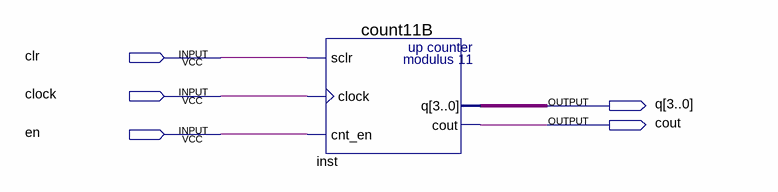
[diagram p0: schematic sheet]
// Quartus schematic cnt11B.bdf as structural Verilog: 1 symbols, 5 pins
module cnt11B (
  input  clr,
  input  clock,
  input  en,
  output [3:0] q,
  output cout
);

  count11B inst (.sclr(clr), .clock(clock), .cnt_en(en), .q(q), .cout(cout));
endmodule
